# EAGLE design air-quality-wing (EAGLE 9.6.2)
AUTHOR: Jared Wolff; BOARD_NUMBER: BRD-0010; COMPANY: Circuit Dojo; DESC: AIR QUALITY WING BOARD; DOC_NUMBER: SCH-0010; DOC_REV: 6; PN: PS-AQW; TITLE: Air Quality Wing
Assembly variants: Production
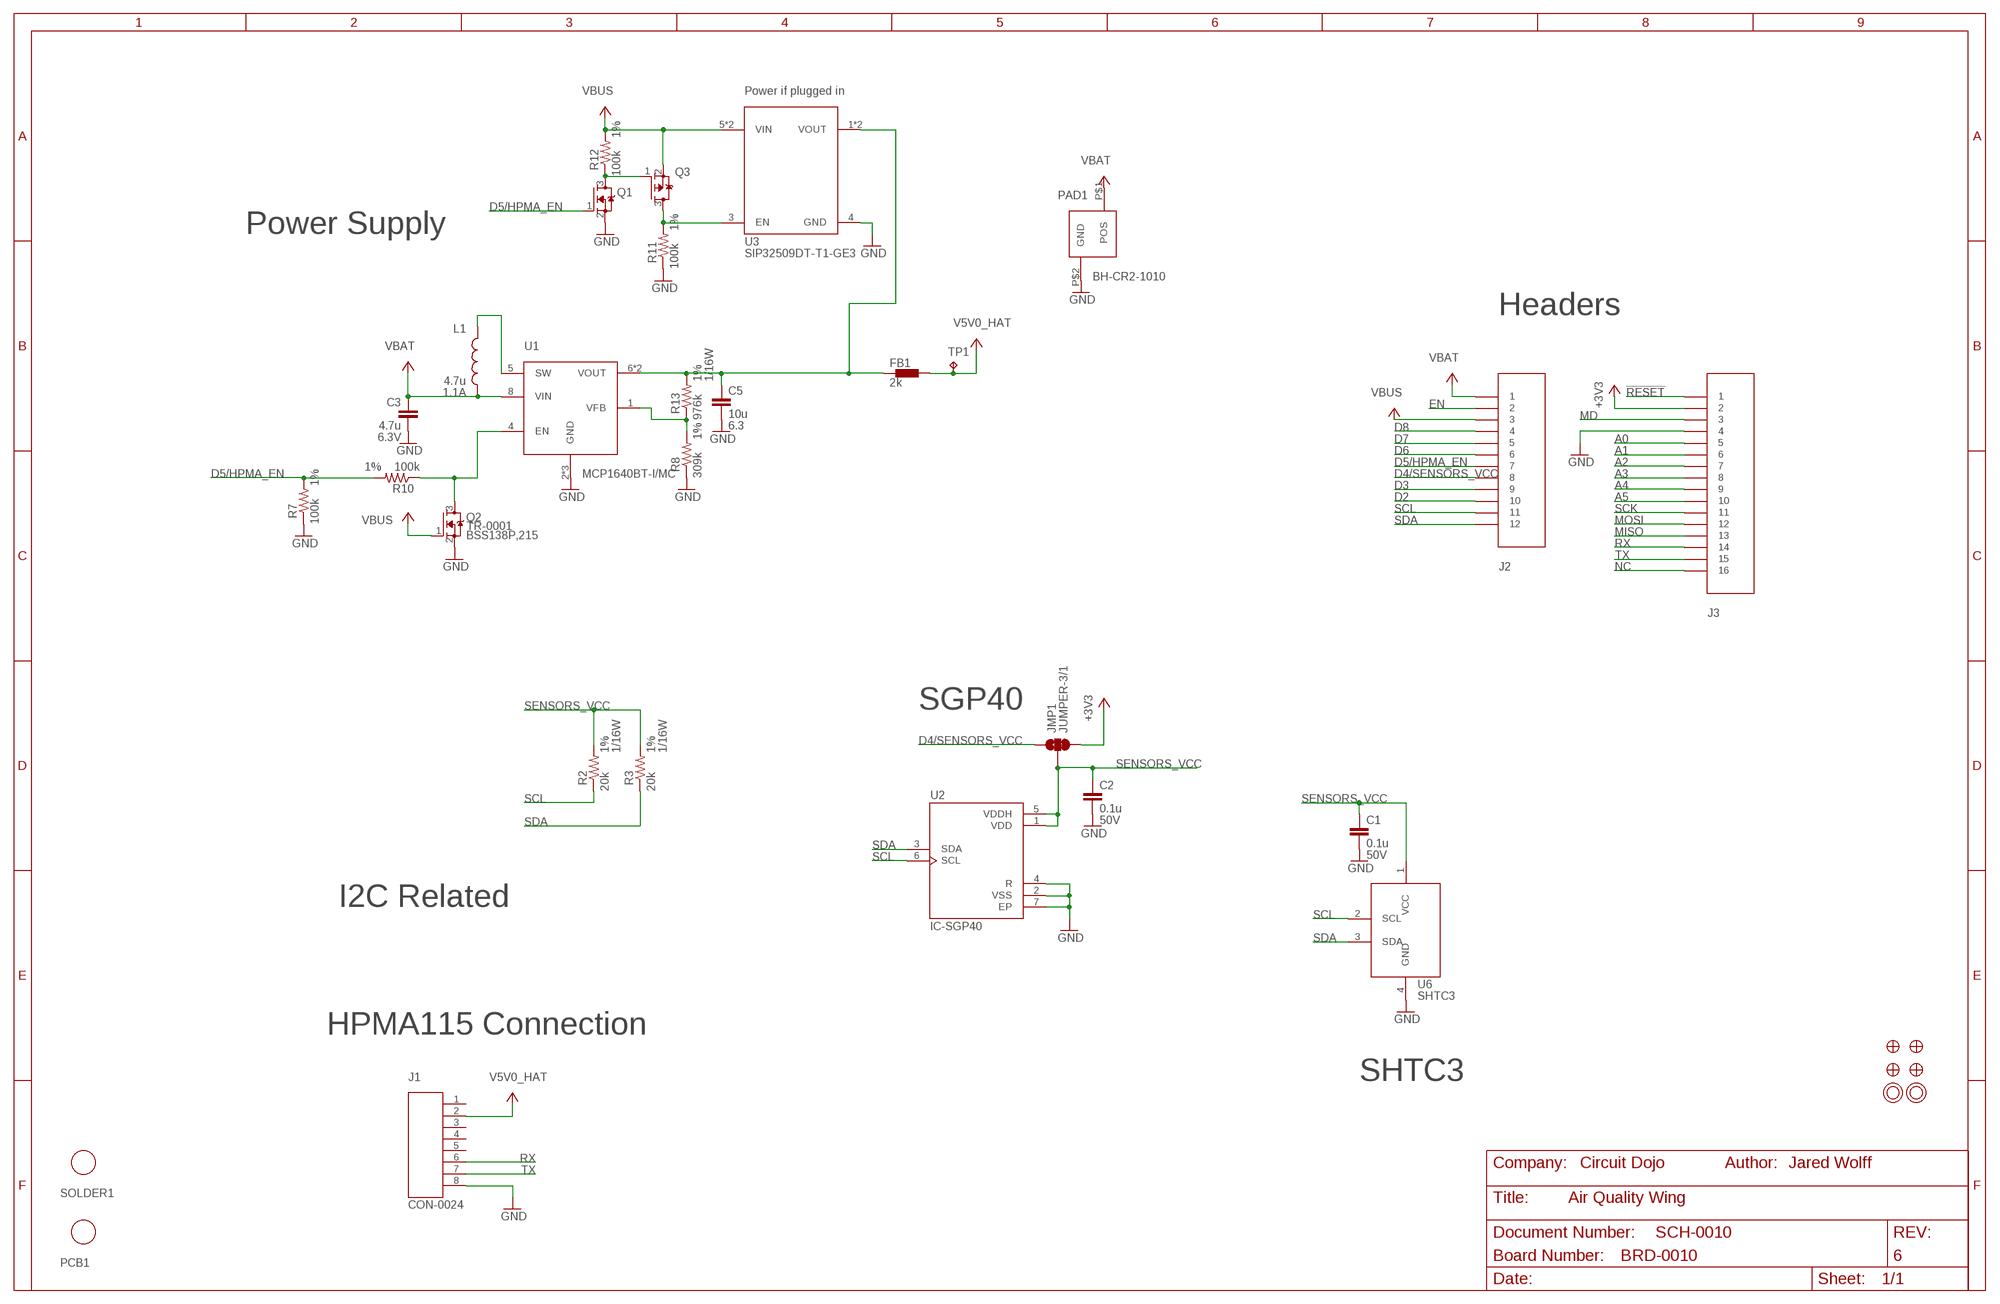
[diagram p0: schematic, sheet 1]

## Parts
C1  0.1u  CAP-0.1U-50V-0402  [CAPC1005X55N]
C2  0.1u  CAP-0.1U-50V-0402  [CAPC1005X55N]
C3  4.7u  CAP-4.7U-6.3V-0603  [C0603]
C5  10u  CAP-10U-6.3V-0603  [C0603]
FB1  2k  FERRITE-0805  [R0805]
J1  CON-0024  [0532610871]
J2  CON-HEADER-1X12-PPPC121LFBN-RC  [CON-HEADER-1X12]
J3  CON-HEADER-1X16-PPPC161LFBN-RC  [CON-HEADER-1X16]
JMP1  JUMPER-3/1  [JUMPER-ROUND-3-NO-R]
L1  4.7u  IND-0003  [IND-2P0X2P0X1P2]
PAD1  BH-CR2-1010  [1010]
PCB1  PCB-PS-AQW  [PLACEHOLDER]
Q1  TR-0001  [SOT23]
Q2  TR-0001  [SOT23]
Q3  TR-0003  [SOT23@1]
R2  20k  RES-20K-1%-0402  [R0402-M]
R3  20k  RES-20K-1%-0402  [R0402-M]
R7  100k  RES-100K-1%-0402  [R0402-M]
R8  309k  RES-309K-1%-0402  [R0402-M]
R10  100k  RES-100K-1%-0402  [R0402-M]
R11  100k  RES-100K-1%-0402  [R0402-M]
R12  100k  RES-100K-1%-0402  [R0402-M]
R13  976k  RES-976K-1%-0402  [R0402-M]
SOLDER1  SOLDER  SOLDER-PASTE-ROOM-TEMP-50G  [PLACEHOLDER]
TP1  TP  [TP-1P27]
U1  POWER-VREG-FB-EN-SW-350MA-DFN8  [DFN200X300X100-9N]
U2  IC-SGP40  [XDCR_SGP30-2.5K]
U3  POWER-SWITCH-SIP32509-SO23-6  [SOT23-6]
U6  IC-SHTC3  [IC-SHTC3]
U$3  FIDUCIAL-1MM  [FIDUCIAL-1MM]
U$4  FIDUCIAL-1MM  [FIDUCIAL-1MM]
U$31  MOUNTING-HOLE-2.5MM-PLATED  [MOUNTING-HOLE-2.5MM-PLATED]
U$32  MOUNTING-HOLE-2.5MM-PLATED  [MOUNTING-HOLE-2.5MM-PLATED]
U$34  FIDUCIAL-1MM  [FIDUCIAL-1MM]
U$35  FIDUCIAL-1MM  [FIDUCIAL-1MM]

## Nets
!RESET: J3.1
+3V3: J3.2 JMP1.P$3
A0: J3.5
A1: J3.6
A2: J3.7
A3: J3.8
A4: J3.9
A5: J3.10
D2: J2.10
D3: J2.9
D4/SENSORS_VCC: J2.8 JMP1.P$1
D5/HPMA_EN: J2.7 Q1.1(G) R7.2 R10.2
D6: J2.6
D7: J2.5
D8: J2.4
EN: J2.2
GND: C1.2 C2.2 C3.2 C5.2 J1.8 J3.4 PAD1.P$2(GND) Q1.2(S) Q2.2(S) R7.1 R8.1 R11.1 U1.2(GND) U1.3(GND) U1.9(GND) U2.2(VSS) U2.4(R) U2.7(EP) U3.4(GND) U6.4(GND)
LOAD_SW_EN: Q3.3(D) R11.2 U3.3(EN)
MD: J3.3
MISO: J3.13
MOSI: J3.12
N$2: R8.2 R13.1 U1.1(VFB)
NC: J3.16
Q1_D: Q1.3(D) Q3.1(G) R12.1
RX: J1.6 J3.14
SCK: J3.11
SCL: J2.11 R2.1 U2.6(SCL) U6.2(SCL)
SDA: J2.12 R3.1 U2.3(SDA) U6.3(SDA)
SENSORS_VCC: C1.1 C2.1 JMP1.P$2 R2.2 R3.2 U2.1(VDD) U2.5(VDDH) U6.1(VCC)
TX: J1.7 J3.15
V5V0_BEAD: C5.1 FB1.1 R13.2 U1.6(VOUT) U1.7(VOUT) U3.1(VOUT) U3.2(VOUT)
V5V0_EN: Q2.3(D) R10.1 U1.4(EN)
V5V0_HAT: FB1.2 J1.2 TP1.P$1(TP) TP1.P$2(TP) TP1.TP
V5V0_SW: L1.P$1 U1.5(SW)
VBAT: C3.1 J2.1 L1.P$2 PAD1.P$1(POS) U1.8(VIN)
VBUS: J2.3 Q2.1(G) Q3.2(S) R12.2 U3.5(VIN) U3.6(VIN)
Unconnected: J1.1 J1.3 J1.4 J1.5

## Notes on the sheet
- Power if plugged in
- Power Supply
- Headers
- SGP40
- I2C Related
- HPMA115 Connection
- SHTC3

## Library data of the parts
C1 C2 = wolff-den:CAP: CAPACITOR; DESC: CAP CER 0.1UF 50V X5R 0402; DIGIKEYPN: 587-3499-1-ND; MF: Taiyo Yuden; MPN: UMK105BJ104KV-F; VOLTHIGH: 50V
C3 = wolff-den:CAP: CAPACITOR; DESC: CAP CER 4.7UF 6.3V X7R 0603; DIGIKEYPN: 1276-2087-1-ND; MPN: CL10B475KQ8NQNC; TEMPHIGH: 125; TEMPLOW: -55; VOLTHIGH: 6.3V
C5 = wolff-den:CAP: CAPACITOR; DESC: CAP CER 10UF 6.3V X5R 0603; DIGIKEYPN: 587-5869-1-ND; MPN: JMK107ABJ106MA-T; VOLTHIGH: 6.3
FB1 = wolff-den:FERRITE: FERRITE BEAD; DESC: FERRITE BEAD 2 KOHM 0805 1LN; DIGIKEYPN: 1276-6330-1-ND; MPN: CIM21J202NE
J1 = wolff-den:CON-0024; DESC: CONN HEADER SMD R/A 8POS 1.25MM; DIGIKEYPN: WM7626CT-ND; MPN: 0532610871
J2 = wolff-den:CON-HEADER-1X12; DESC: CONN HDR 12POS 0.1 GOLD PCB; DIGIKEYPN: S7045-ND; MF: Sullins Connector Solutions; MPN: PPPC121LFBN-RC
J3 = wolff-den:CON-HEADER-1X16; DESC: CONN HDR 16POS 0.1 GOLD PCB; DIGIKEYPN: S7049-ND; MF: Sullins Connector Solutions; MPN: PPPC161LFBN-RC
JMP1 = wolff-den:JUMPER-3/1
L1 = wolff-den:IND-0003: FIXED IND 4.7UH 750MA 390 MOHM; CURRENT: 1.1A; DIGIKEYPN: 587-4705-1-ND; MPN: NRV2012T4R7MGF
PAD1 = wolff-den:BH
PCB1 = wolff-den:PCB; MPN: BRD-0010
Q1 Q2 = wolff-den:TR-0001: MOSFET N-CH 60V 360MA TO-236AB; DESC: MOSFET N-CH 60V 360MA TO-236AB; DIGIKEYPN: 1727-1142-1-ND; MPN: BSS138P,215; TEMPHIGH: 150; TEMPLOW: -55
Q3 = wolff-den:TR-0003: MOSFET P-CH 50V 130MA SOT23-3; DIGIKEYPN: BSS84-FDICT-ND; MPN: BSS84-7-F; TEMPHIGH: 150; TEMPLOW: -55
R2 R3 = wolff-den:RES: RESISTOR; DESC: RES SMD 20K OHM 1% 1/16W 0402; DIGIKEYPN: 311-20.0KLRCT-ND; MF: Yageo; MPN: RC0402FR-0720KL; POWER: 1/16W; TOLERANCE: 1%
R7 R10-R12 = wolff-den:RES: RESISTOR; DESC: RES SMD 100K OHM 1% 1/16W 0402; DIGIKEYPN: 311-100KLRCT-ND; MPN: RC0402FR07100KL; POWER: 1/16W; TOLERANCE: 1%
R8 = wolff-den:RES: RESISTOR; DESC: RES SMD 309K OHM 1% 1/16W 0402; DIGIKEYPN: YAG3108CT-ND; MPN: RC0402FR-07309KL; POWER: 1/16W; TOLERANCE: 1%
R13 = wolff-den:RES: RESISTOR; DESC: RES SMD 976K OHM 1% 1/16W 0402; DIGIKEYPN: YAG3265CT-ND; MF: Yageo; MPN: RC0402FR-07976KL; POWER: 1/16W; TOLERANCE: 1%
SOLDER1 = wolff-den:SOLDER; DESC: THERMALLY STABLE SOLDER PASTE NO; MPN: TS391SNL50; MQTY: 150
TP1 = wolff-den:TP: TEST POINT
U1 = wolff-den:POWER-VREG-FB-EN-SW: IC CONV BOOST SOT-23-6; DESC: IC REG BOOST ADJ 350MA 8DFN; MF: Microchip Technology; MPN: MCP1640BT-I/MC
U2 = wolff-den:IC-SGP40: Gas Sensor, 0.048a/1.8v, I2c, Dfn-6; DESC: AIR QUALITY GAS SENSOR FOR VOC'S; DIGIKEYPN: 1649-SGP40-D-R4CT-ND; MF: Sensirion AG; MPN: SGP40-D-R4
U3 = wolff-den:POWER-SWITCH: IC SWITCH; DESC: IC LOAD SWITCH SOT23-6; DIGIKEYPN: SIP32509DT-T1-GE3CT-ND; MPN: SIP32509DT-T1-GE3
U6 = wolff-den:IC-SHTC3; DESC: SENSOR HUMI/TEMP I2C 2% SMD; DIGIKEYPN: 1649-1100-1-ND; MF: SENSIRION; MPN: SHTC3
U$3 U$4 U$34 U$35 = wolff-den:FIDUCIAL
U$31 U$32 = wolff-den:MOUNTING-HOLE

## Board
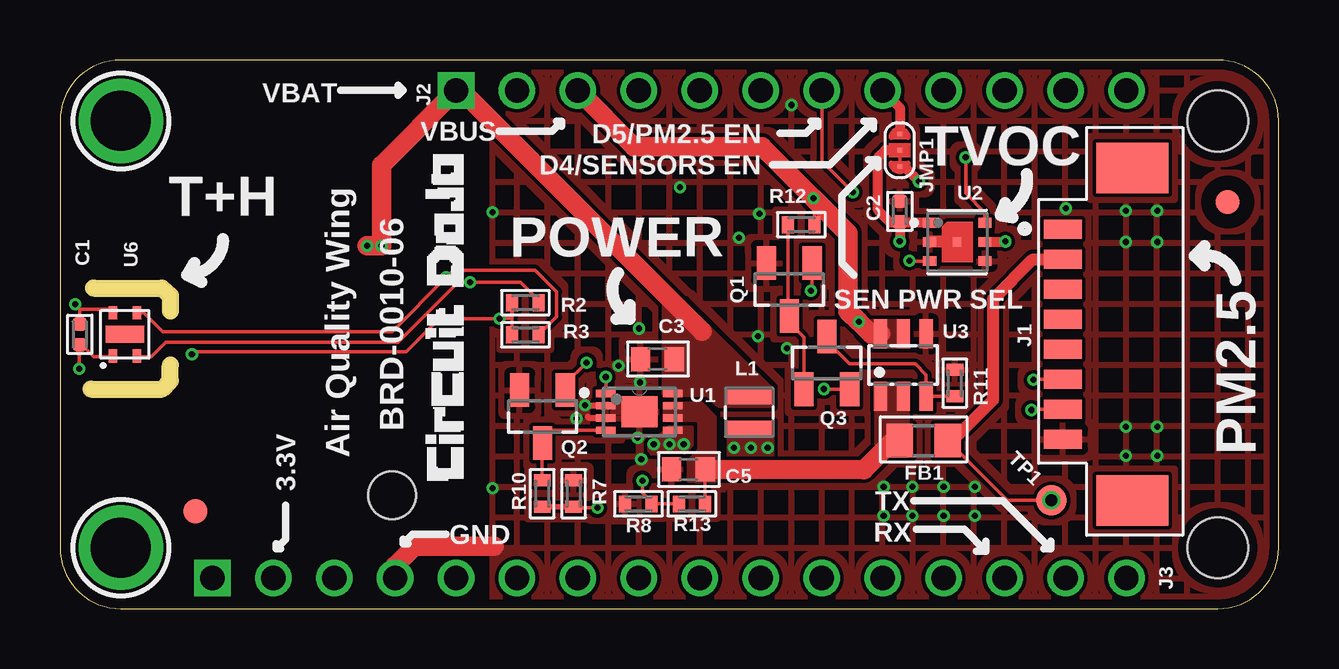
[diagram p1: board, top side]
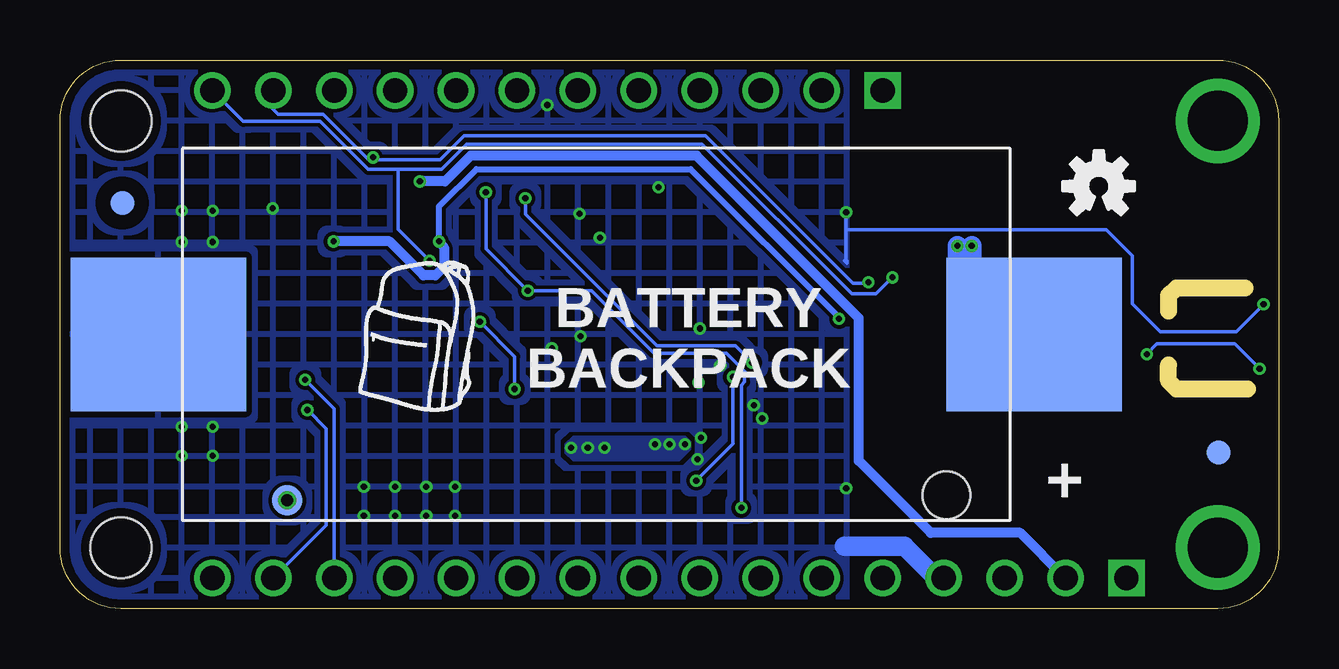
[diagram p2: board, bottom side, seen from below]

Size 50.8 x 22.86 mm. Coordinates in mm from the lower left corner, seen from the top.
Outline: 1.3,9.15 4.25,9.15 4.6,9.5 4.6,10.15
Outline: 1.4,13.35 4.25,13.35 4.6,13.05 4.6,12.4
Outline: 2.54,0 48.26,0 arc90 50.8,2.54 50.8,20.32 arc90 48.26,22.86 2.54,22.86 arc90 0,20.32 0,2.54 arc90 2.54,0
Copper layers (1*16): Top 0.035559375mm / dielectric 1.6mm / Bottom 0.035559375mm
Design rules "oshpark-2layer *": minimum track width 6mil, minimum drill 10mil, track to track 6mil, track to pad 6mil, pad to pad 6mil, via to via 6mil, smd to smd 6mil, copper to edge 15mil, drill to drill 6mil, minimum pad ring 5mil, minimum via ring 5mil, stop-mask expansion 2.5mil, vias tented up to drill 0.45mm, thermal gap 10mil
Holes 2.54 mm at 48.26,20.32 48.26,2.54
Milling: 6 lines

### Footprints (pad centres in the part's own frame; a part is rotated, then mirrored left to right if it is on the bottom)
CAPC1005X55N = smd 0.54 x 0.6: 1 -0.43,0; 2 0.43,0
C0603 = smd 0.8 x 1: 1 -0.7,0; 2 0.7,0
R0805 = smd 1.1 x 1.4: 1 -1,0; 2 1,0
0532610871 = smd 0.8 x 1.6: 1 4.375,0; 2 3.125,0; 3 1.875,0; 4 0.625,0; 5 -0.625,0; 6 -1.875,0; 7 -3.125,0; 8 -4.375,0 | smd 2.1 x 3: P$9 -6.925,-2.9; P$10 6.925,-2.9
CON-HEADER-1X12 = drill 1.016 square: 1 0,0 | drill 1.016: 2 2.54,0; 3 5.08,0; 4 7.62,0; 5 10.16,0; 6 12.7,0; 7 15.24,0; 8 17.78,0; 9 20.32,0; 10 22.86,0; 11 25.4,0; 12 27.94,0
CON-HEADER-1X16 = drill 1.016 square: 1 0,0 | drill 1.016: 2 2.54,0; 3 5.08,0; 4 7.62,0; 5 10.16,0; 6 12.7,0; 7 15.24,0; 8 17.78,0; 9 20.32,0; 10 22.86,0; 11 25.4,0; 12 27.94,0; 13 30.48,0; 14 33.02,0; 15 35.56,0; 16 38.1,0
JUMPER-ROUND-3-NO-R = smd 0.2 x 0.2: P$1 -0.675,0; P$2 0,0; P$3 0.675,0
IND-2P0X2P0X1P2 = smd 0.65 x 2: P$1 -0.675,0; P$2 0.675,0
1010 = smd 7.3 x 6.4: P$1 -18.25,0; P$2 18.25,0 | hole 1.98: -14.6,6.7
SOT23 = smd 0.8 x 1.4: 1 -0.95,-1.1; 2 0.95,-1.1; 3 0,1.1
SOT23@1 = smd 0.8 x 1.4: 1 -0.95,-1.1; 2 0.95,-1.1; 3 0,1.1
R0402-M = smd 0.5 x 0.7: 1 -0.55,0; 2 0.55,0
TP-1P27 = drill 0.5: P$1 0,0 | smd 1.27 x 1.27 bottom: P$2 0,0 | smd 1.27 x 1.27: TP 0,0
DFN200X300X100-9N = smd 0.813 x 0.305: 1 -1.397,0.762; 2 -1.397,0.254; 3 -1.397,-0.254; 4 -1.397,-0.762; 5 1.397,-0.762; 6 1.397,-0.254; 7 1.397,0.254; 8 1.397,0.762 | smd 1.499 x 1.295: 9 0,0
XDCR_SGP30-2.5K = smd 0.55 x 0.4: 1 -1.15,0.8; 2 -1.15,0; 3 -1.15,-0.8; 4 1.15,-0.8; 5 1.15,0; 6 1.15,0.8 | smd 0.35 x 0.4: 7 0,0
SOT23-6 = smd 0.55 x 1.2: 1 -0.95,-1.3; 2 0,-1.3; 3 0.95,-1.3; 4 0.95,1.3; 5 0,1.3; 6 -0.95,1.3
IC-SHTC3 = smd 0.55 x 0.35: 1 -0.9,0.5; 2 -0.9,-0.5; 3 0.9,-0.5; 4 0.9,0.5 | smd 0.7 x 1.6: PAD 0,0
FIDUCIAL-1MM = smd 1 x 1: 1 0,0
MOUNTING-HOLE-2.5MM-PLATED = drill 2.5 pad 3.2: P$1 0,0

### Placement (x,y rotation side)
C1  0.83,11.43 90 top
C2  35,16.55 90 top
C3  24.9,10.4 180 top
C5  26.19,5.8 180 top
FB1  36,7 0 top
J1  41.8,11.43 90 top
J2  16.51,21.59 0 top
J3  6.35,1.27 0 top
JMP1  35,19.1 270 top
L1  28.73,8.18 90 top
PAD1  28.45,11.43 180 bottom
PCB1  -12.93,-5.08 0 top  (outside the outline)
Q1  30.4,13.3 180 top
Q2  20.11,8 180 top
Q3  31.96,10.24 0 top
R2  19.4,12.75 180 top
R3  19.4,11.41 180 top
R7  21.41,4.79 270 top
R8  24.11,4.36 0 top
R10  20.1,4.79 270 top
R11  37.3,9.4 270 top
R12  30.9,16 0 top
R13  26.34,4.36 0 top
SOLDER1  -12.35,-9.1 0 top  (outside the outline)
TP1  41.33,4.51 180 top
U1  24.15,8.2 0 top
U2  37.4,15.28 0 top
U3  35.15,10.15 0 top
U6  2.7,11.43 90 top
U$1  [OSHW-LOGO-S]  7.5,17.6 0 bottom
U$2  [LOGO-CIRCUITDOJO]  17.2,5.1 90 top
U$3  2.5,6.5 0 bottom
U$4  48.2,16.9 0 bottom
U$5  [BACKPACK]  39.1,7.6 0 bottom
U$6  [A3L-LOC]  -169.25,-122.35 0 top  (outside the outline)
U$31  2.54,20.32 270 top
U$32  2.54,2.54 270 top
U$34  5.65,4.06 270 top
U$35  48.67,16.94 270 top

### Tracks (layer width: path | path; a pad name or v marks a point on that pad's centre or on a via)
+3V3  (via drill 0.25)
  Top 0.406: JMP1.P$3 35.17,18.43 v35.8,17.8
  Bottom 0.406: J3.2 10.78,3.16 14.5,3.16 17.5,6.15 17.5,12.11 24.27,18.88 33.67,18.88 34.75,17.8 v35.8,17.8
D4/SENSORS_VCC
  Top 0.406: J2.8 35,20.88 JMP1.P$1
D5/HPMA_EN  (via drill 0.25)
  Top 0.152: J2.7 31.75,18.65 v33.05,17.35 | Q1.1 31.35,13.3 v31.3,13.25 | v22.4,4.2 20.14,4.2 R10.2
  Top 0.203: R7.2 R10.2
  Bottom 0.152: v33.05,17.35 33.05,15 v31.3,13.25 28.64,13.25 26.04,10.64 23.03,10.64 22.25,9.87 22.27,9.85 22.27,9.45 22.4,9.32 v22.4,4.2
GND  (via drill 0.25)
  Top 0.152: C1.2 0.83,12.48 | 0.83,12.48 v0.64,12.68 | U6.4 2.04,12.48 0.83,12.48
  Top 0.254: 22,8.4 22.05,8.45 U1.2 | 22,8 22.06,7.94 U1.3
  Top 0.508: U2.7 U2.2
  Top 0.813: J3.4 13.97,1.78 14.79,2.6 18.1,2.6
  Bottom 0.152: v0.64,12.68 0.73,12.68 0.73,12.58 1.77,11.54 4.94,11.54 6.1,12.7 6.1,14.7 7.2,15.79 18.03,15.79 v18.03,16.52 18.03,14.43 18,14.4 18,14.5 18.1,14.5
  Bottom 0.813: J3.4 14.27,1.27 15.6,2.6 18.1,2.6
  other vias: 41.93,16.68 28.3,15.45 25.85,17.55 29.15,16.45 30.3,10.85 29.1,11.35 30.49,20.98 18.03,5.02 38.13,3.88 38.13,5.08 36.83,5.08 36.83,3.88 44.43,15.28 45.73,15.28 45.73,16.57 44.43,16.57 44.43,6.38 45.73,6.38 35.53,3.88 35.53,5.08 44.43,7.58 45.73,7.58 34.33,3.88 34.33,5.08 24.23,6.22 24.08,7.12 24.18,9.42 23.28,10.12 24.13,11.67 21.88,8.47 21.53,7.92
  pour Top (rank 3, hatched): 18,22.86 18,0 50.8,0 50.8,22.86
  pour Bottom (rank 2, hatched): 50.8,0 18,0 18,22.86 50.8,22.86
LOAD_SW_EN
  Top 0.152: Q3.3 31.96,11.14 32.91,10.2 35.65,10.2 36.1,9.75 U3.3 R11.2
N$2  (via drill 0.25)
  Top 0.152: v22.75,9.65 v22.76,9.64 U1.1 | R13.1 R8.2 24.66,4.46 24.28,4.84 v24.28,5.33
  Bottom 0.152: v24.28,5.33 22.75,6.86 v22.75,9.65
Q1_D
  Top 0.152: Q3.1 31,9.15 31,11.3 30.4,11.9 30.4,12 | 30.4,12 Q1.3 | R12.1 30.35,12.05 30.4,12
RX  (via drill 0.25)
  Top 0.152: J1.6 40.6,9.55 v40.58,9.54
  Bottom 0.152: v40.58,9.54 39.37,8.33 J3.14
SCL  (via drill 0.25)
  Top 0.152: U2.6 38.55,16.5 37.75,17.3 v37.75,18.8 | U6.2 3.23,10.5 3.8,10.5 4.4,11.1 14.1,11.1 16.6,13.6 v17.1,13.6 19.2,13.6 19.95,12.85 R2.1
  Bottom 0.152: J2.11 41.95,21.55 41.95,20.85 41.7,20.61 39.82,20.61 37.87,18.65 37.75,18.65 v37.75,18.8 37.65,18.7 34.95,18.7 33.95,19.7 23.9,19.7 17.75,13.55 17.15,13.55 v17.1,13.6
SDA  (via drill 0.25)
  Top 0.152: U2.3 35.42,14.48 v35.4,14.5 | U6.3 3.49,12.33 4.28,11.54 13.84,11.54 v16.1,13.8 16.4,14.1 19.8,14.1 20.7,13.2 20.7,12.16 R3.1
  Bottom 0.152: J2.12 43.16,20.3 39.95,20.3 37.95,18.3 36.7,18.3 | 36.7,18.3 34.9,18.3 33.85,19.35 24.03,19.35 17.8,13.12 16.78,13.12 v16.1,13.8 | v35.4,14.5 36.7,15.8 36.7,18.3
SENSORS_VCC  (via drill 0.25)
  Top 0.152: R2.2 18.85,12.1 | 18.85,12.1 R3.2 | 18.85,12.1 18.35,12.1 v18.33,12.07 15.8,12.07 14.43,10.7 5.59,10.7 v5.5,10.6 | v0.8,10 0.8,10.97 C1.1 0.9,11 1.4,10.5 2.17,10.5 U6.1
  Top 0.406: 35.04,16.08 C2.1 v35,15.3 | 35.04,16.08 34.62,16.08 34.1,16.6 34.1,18.8 34.4,19.1 JMP1.P$2 | v39.4,15.3 39.38,15.28 U2.5 | U2.1 35.04,16.08
  Bottom 0.152: v5.5,10.6 v5.5,10.61 5.07,11.04 1.83,11.04 v0.8,10
  Bottom 0.254: v35,15.3 35,16.76 33.44,18.32 24.52,18.32 18.3,12.1
  Bottom 0.406: v39.4,15.3 37.06,15.3 35.65,13.89 35.15,13.89 34.79,14.25 34.79,15.05 35,15.26 v35,15.3 | 18.3,12.1 v18.33,12.07
TX  (via drill 0.25)
  Top 0.152: v40.49,8.28 40.51,8.3 J1.7
  Bottom 0.152: J3.15 39.7,3.48 39.7,7.5 40.48,8.28 v40.49,8.28
V5V0_BEAD
  Top 0.152: 34.86,7.14 FB1.1 | C5.1 R13.2
  Top 0.813: C5.1 33.51,5.79 34.86,7.14
  pour Top (no thermals): 34,9.4 34,6.85 34.5,6.35 35.35,6.35 35.35,9.4
  pour Top (rank 2, no thermals): 25.2,8.55 25.2,7.9 25.6,7.9 26.2,7.3 26.2,5.3 27.3,5.3 27.3,8 26.75,8.55
V5V0_EN
  Top 0.152: U1.4 20.24,7.43 20.11,7.3 Q2.3 R10.1
V5V0_HAT
  Top 0.152: TP1.P$1 39.49,4.51 FB1.2
  Top 0.508: FB1.2 37.2,7 38.9,8.7 38.9,12.9 40.55,14.55 J1.2
V5V0_SW  (via drill 0.25)
  other vias: 28.1,6.7 28.8,6.7 29.5,6.7 25.4,6.85 24.75,6.85 26,6.85
  pour Top (no thermals): 29.65,6.3 29.65,7.7 27.9,7.7 27.9,6.3
  pour Bottom (no thermals): 24.75,7.15 24.55,6.95 24.55,6.65 25,6.2 29.4,6.2 29.7,6.5 29.7,6.85 29.4,7.15
  pour Top (no thermals): 24.55,6.83 24.55,6.5 24.6,6.45 26,6.45 26.35,6.8 26.35,7.55 25.36,7.55
VBAT  (via drill 0.25)
  Top 0.813: 26.75,11.55 16.71,21.59 J2.1 13.4,18.48 v13.4,15.11 v12.8,15.11
  Bottom 0.61: 13.4,13.6 13.4,13.9 12.67,13.9 PAD1.P$1
  Bottom 0.813: v13.4,15.11 13.4,13.9 | v12.8,15.11 12.8,14.5
  pour Top (no thermals): 25.2,8.95 27,8.95 27.45,8.5 29.65,8.5 29.65,9.1 25.95,12.75 25.2,12.75
VBUS  (via drill 0.25)
  Top 0.152: Q3.2 v31.86,9.14 v31.85,9.15 | v31.41,17.09 31.45,17.05 R12.2 | Q2.1 21.06,9.36 v21.95,10.25
  Top 0.813: J2.3 23.93,19.25 29.25,19.25 v31.41,17.09 32.85,15.65 32.85,12.4 v33.3,11.95 33.8,11.45 U3.6
  Bottom 0.152: v31.41,17.09 v31.4,17.09 31.4,16.44 25.91,10.95 22.65,10.95 v21.95,10.25 | v31.85,9.15 31.85,10.5 v33.3,11.95
  pour Top (no thermals): 33.8,12 33.3,11.5 33.9,10.9 35.35,10.9 35.35,12

### Text on the board
tPlace: VBAT | VBUS | D5/PM2.5 EN | TVOC | D4/SENSORS EN | T+H | POWER | SEN PWR SEL | Air Quality Wing | BRD-0010-06 | PM2.5 | 3.3V | TX | GND | RX
bPlace: BATTERY / BACKPACK
Document: Air Quality Wing V6 | Notes: / / * T4 solder paste / * Lead Free assembly / * Measures in mm | Confidential - Property of Circuit Dojo LLC
tDocu: TOP
bDocu: BOT | (Top down)